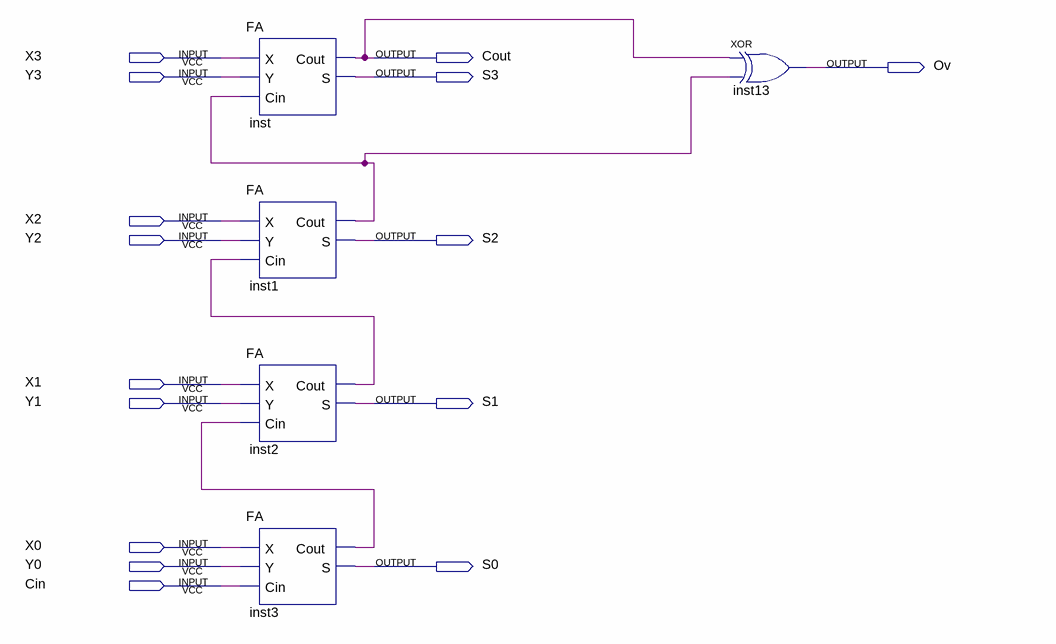
[diagram p0: schematic sheet]
// Quartus schematic lab07.bdf as structural Verilog: 5 symbols, 15 pins
module lab07 (
  input  X3,
  input  Y3,
  input  X2,
  input  Y2,
  input  X1,
  input  Y1,
  input  X0,
  input  Y0,
  input  Cin,
  output Cout,
  output Ov,
  output S3,
  output S2,
  output S1,
  output S0
);

  wire inst1_cout, inst2_cout, inst3_cout;

  FA inst (.X(X3), .Y(Y3), .Cin(inst1_cout), .Cout(Cout), .S(S3));
  FA inst1 (.X(X2), .Y(Y2), .Cin(inst2_cout), .Cout(inst1_cout), .S(S2));
  FA inst2 (.X(X1), .Y(Y1), .Cin(inst3_cout), .Cout(inst2_cout), .S(S1));
  FA inst3 (.X(X0), .Y(Y0), .Cin(Cin), .Cout(inst3_cout), .S(S0));
  xor inst13 (Ov, Cout, inst1_cout);
endmodule
